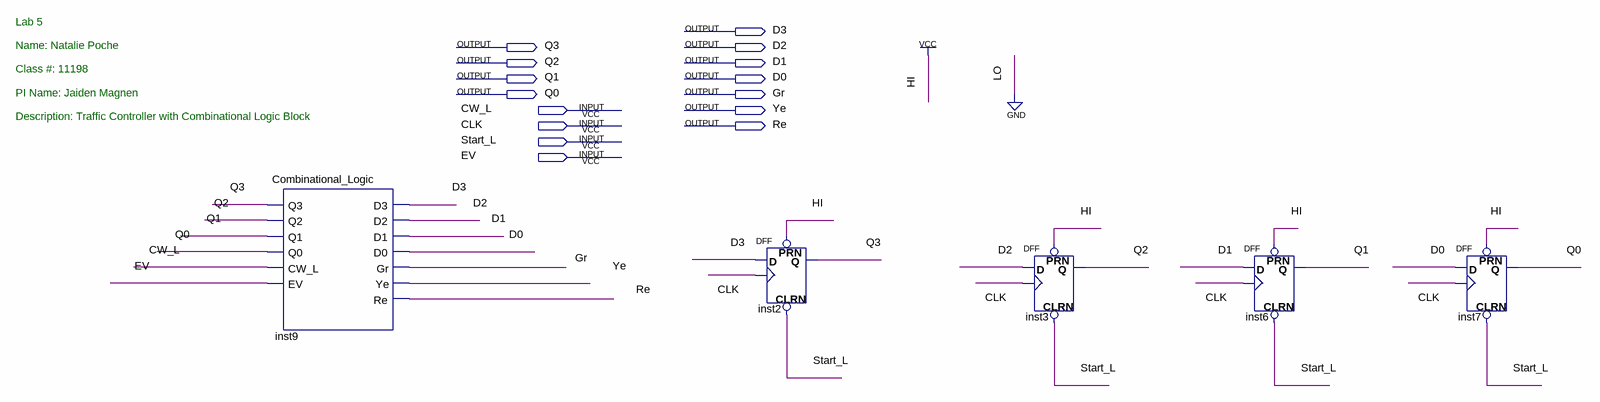
[diagram p0: schematic sheet]
// Quartus schematic Lab5_DFF_Traf_Cont.bdf as structural Verilog: 5 symbols, 15 pins
module Lab5_DFF_Traf_Cont (
  input  CW_L,
  input  CLK,
  input  Start_L,
  input  EV,
  output D3,
  output Q3,
  output D2,
  output Q2,
  output D1,
  output Q1,
  output D0,
  output Q0,
  output Gr,
  output Ye,
  output Re
);

  Combinational_Logic inst9 (
    .Q3(Q3), .Q2(Q2), .Q1(Q1), .Q0(Q0), .CW_L(CW_L), .EV(EV), .D3(D3), .D2(D2), .D1(D1), .D0(D0), .Gr(Gr),
    .Ye(Ye), .Re(Re));
  DFF inst2 (.CLRN(Start_L), .CLK(CLK), .D(D3), .PRN(1'b1), .Q(Q3));
  DFF inst3 (.CLRN(Start_L), .CLK(CLK), .D(D2), .PRN(1'b1), .Q(Q2));
  DFF inst6 (.CLRN(Start_L), .CLK(CLK), .D(D1), .PRN(1'b1), .Q(Q1));
  DFF inst7 (.CLRN(Start_L), .CLK(CLK), .D(D0), .PRN(1'b1), .Q(Q0));

  // Notes on the sheet:
  //   Lab 5
  //   Name: Natalie Poche
  //   Class #: 11198
  //   PI Name: Jaiden Magnen
  //   Description: Traffic Controller with Combinational Logic Block
endmodule
